# EAGLE schematic AK4493-v1.64_9 (EAGLE 9.6.2)
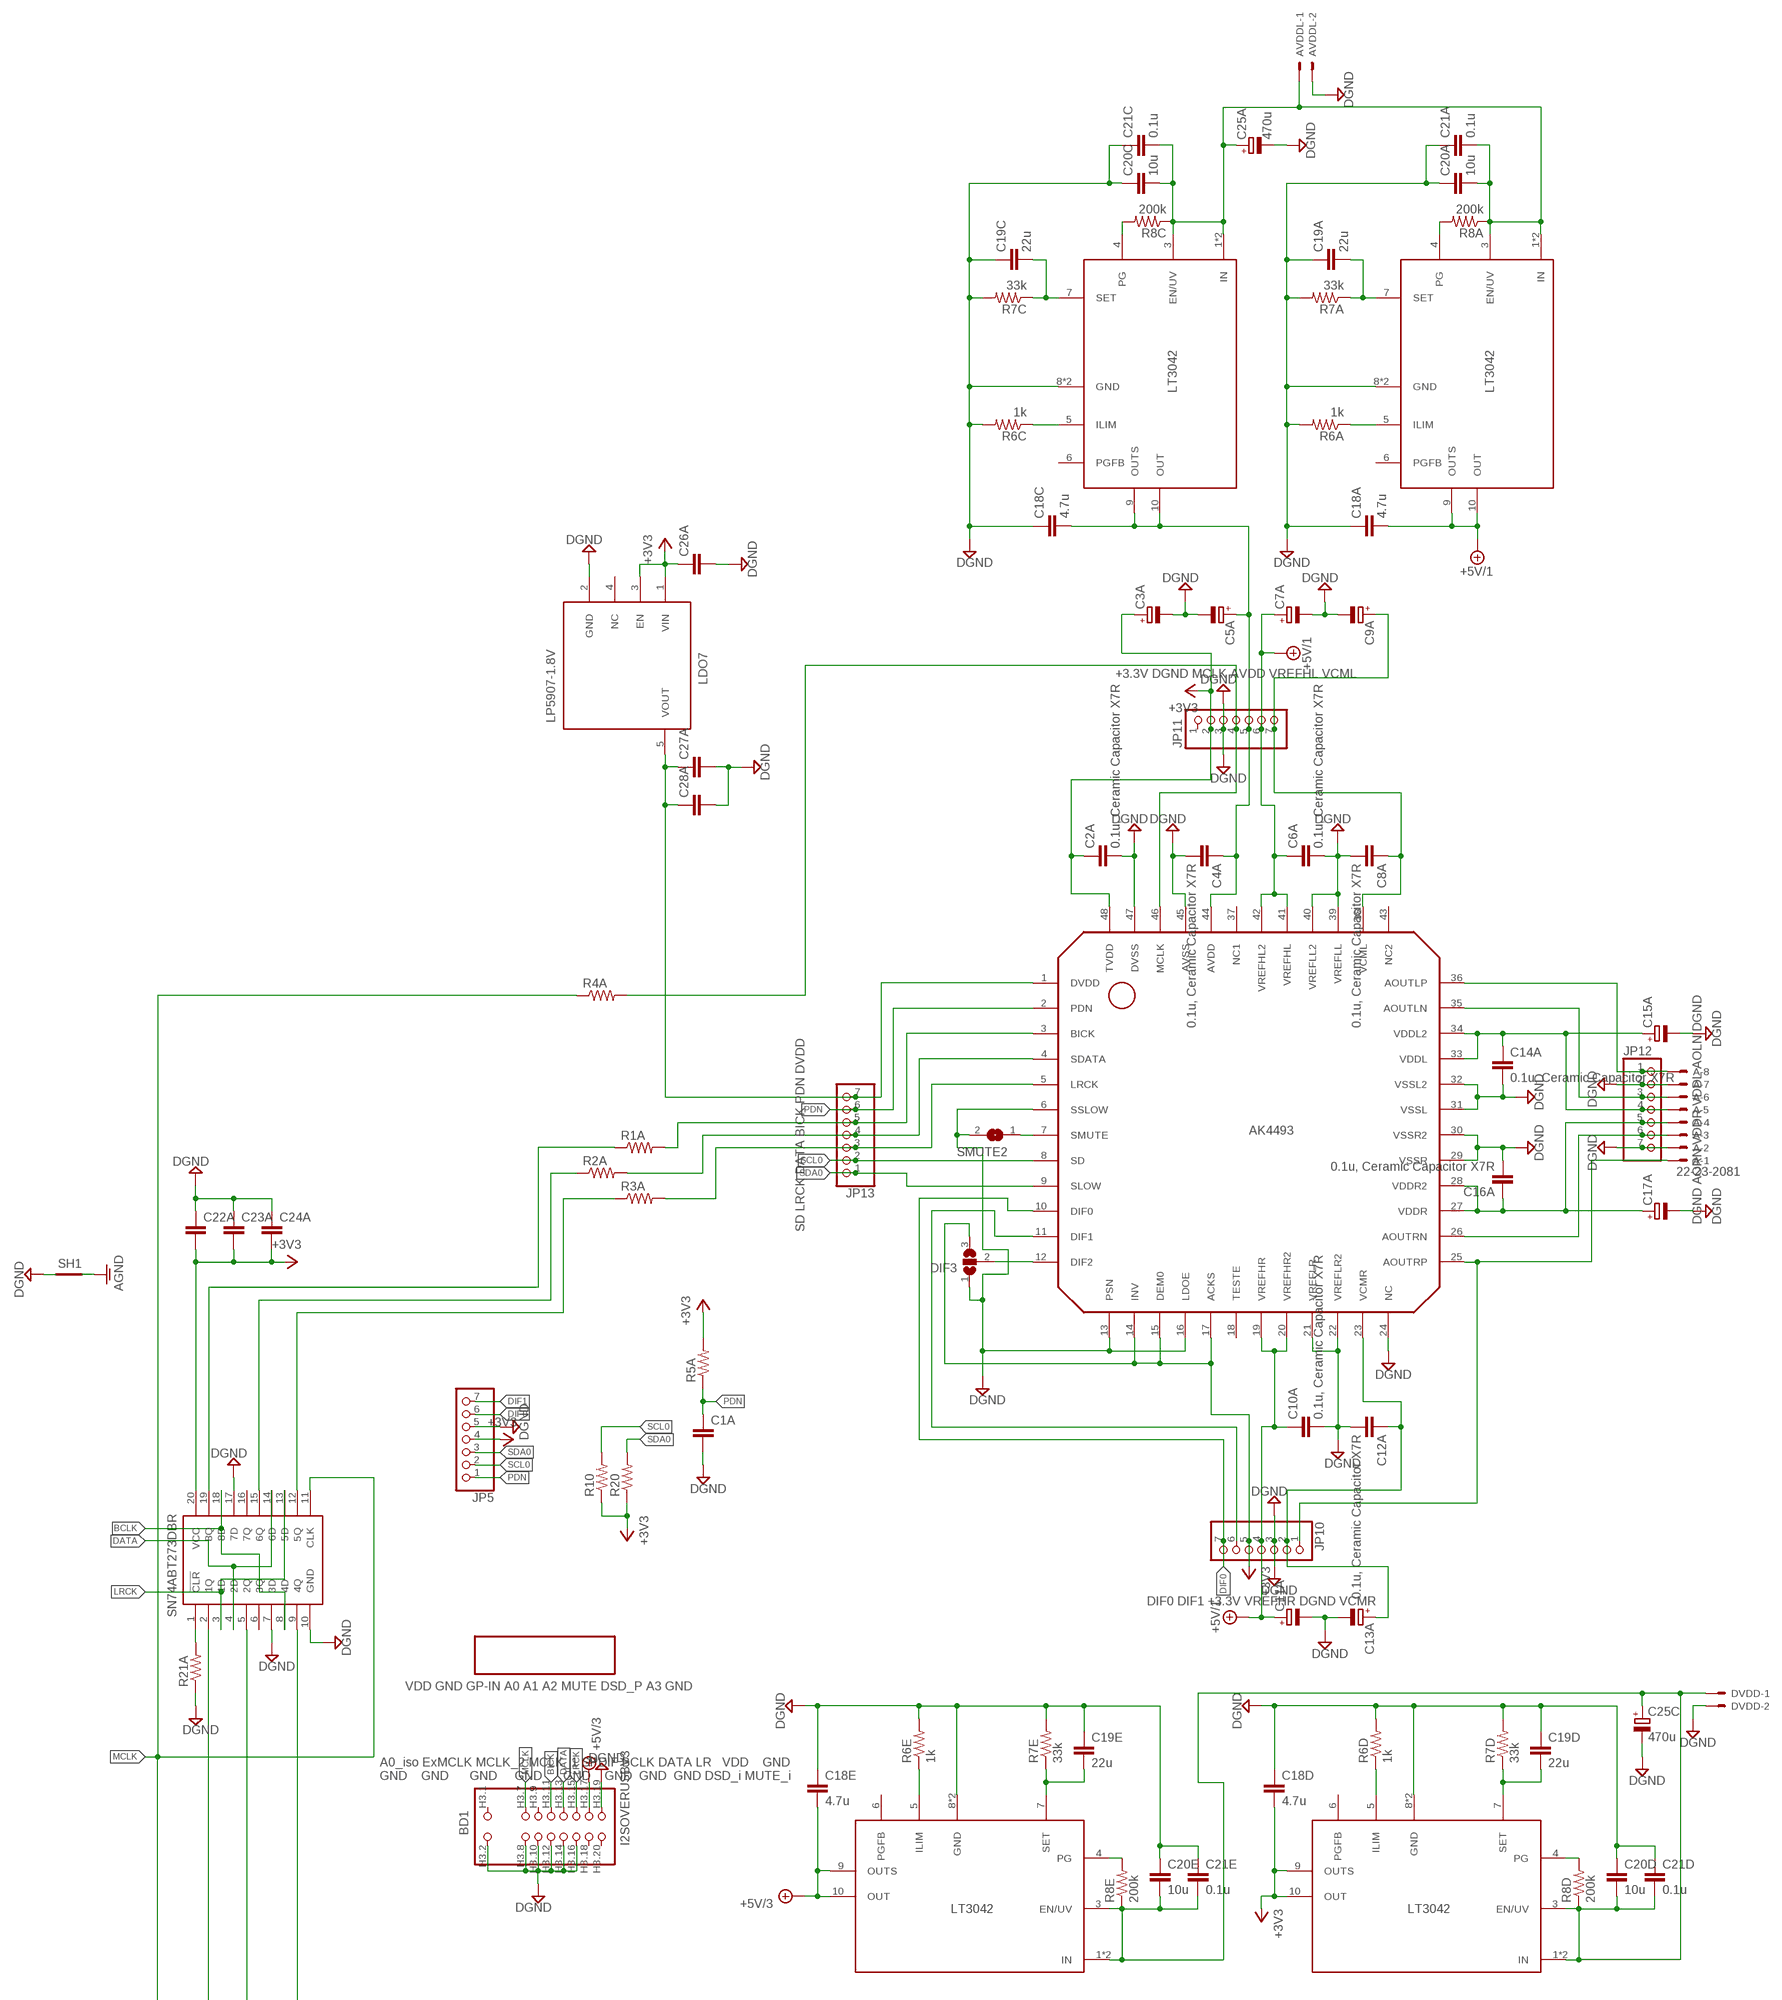
[diagram p0: schematic, sheet 1, part 1 of 2]
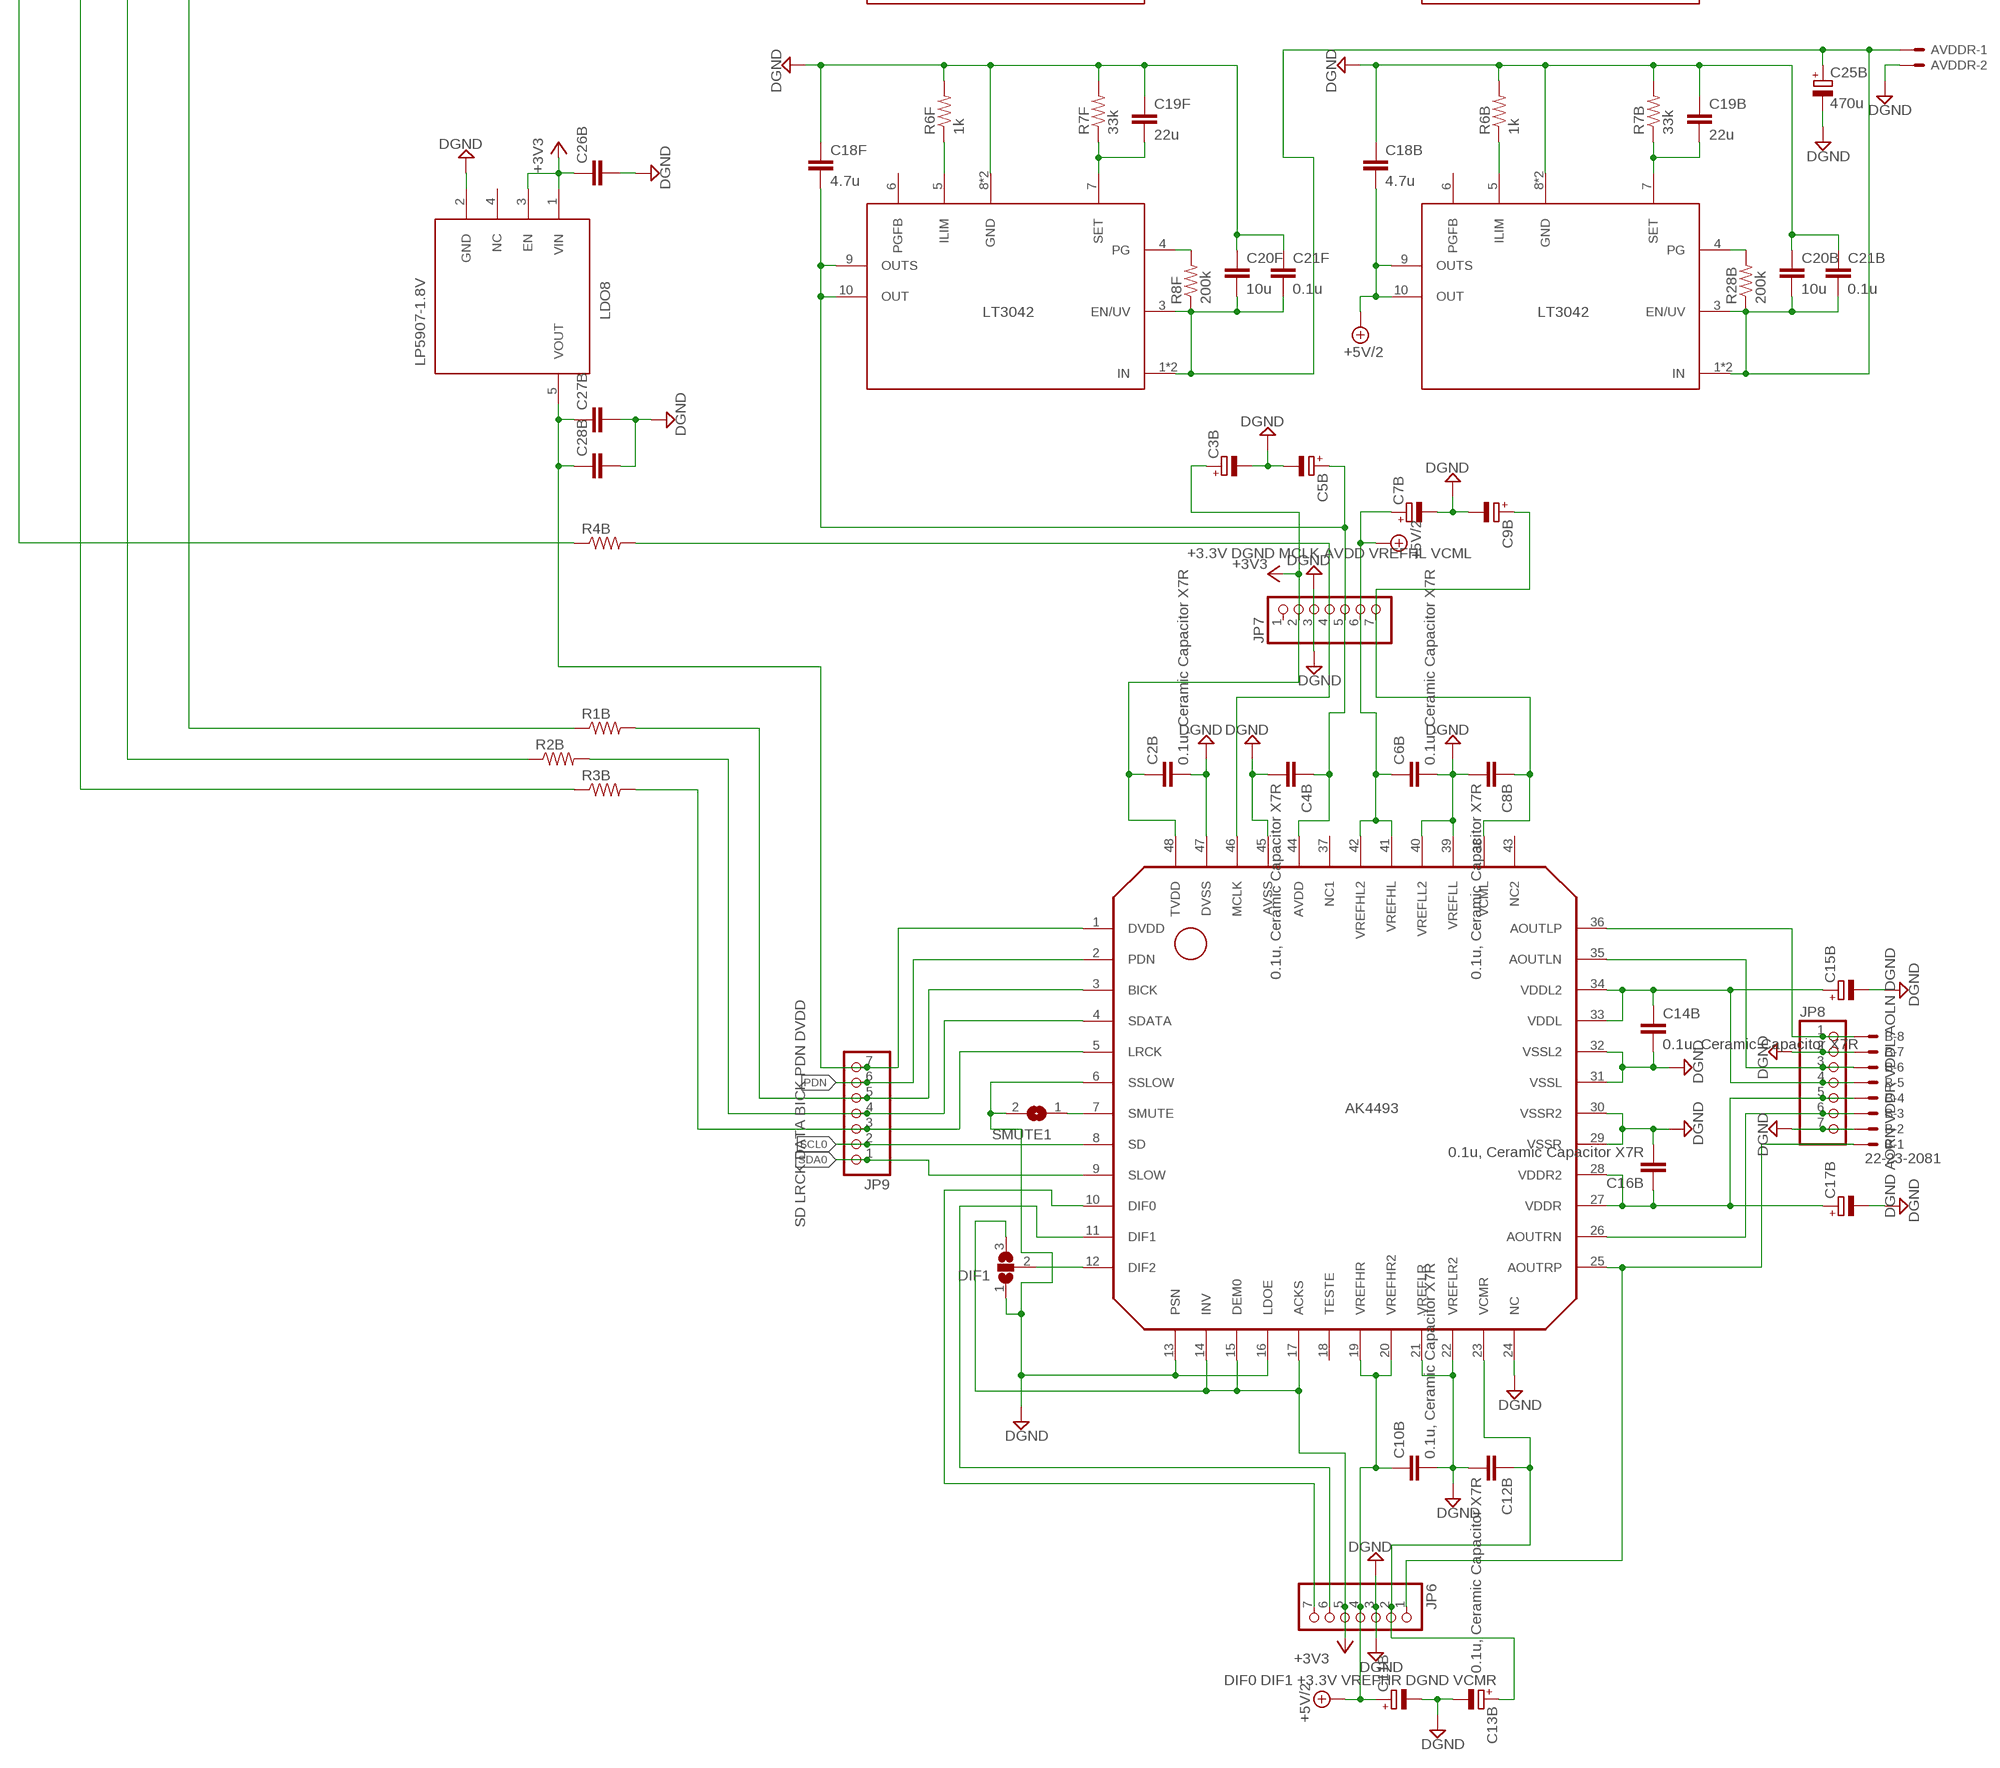
[diagram p1: schematic, sheet 1, part 2 of 2]

## Parts
A  22-23-2081  [22-23-2081]
AVDDL  22-23-2021  [22-23-2021]
AVDDR  22-23-2021  [22-23-2021]
B  22-23-2081  [22-23-2081]
BD1  I2SOVERUSBV3  [I2SOVERUSBV3]
C1A  C-EUC0805K  [C0805K]
C2A  0.1u, Ceramic Capacitor X7R  C-EUC0201  [C0201]
C2B  0.1u, Ceramic Capacitor X7R  C-EUC0201  [C0201]
C3A  CPOL-EUE2.5-5  [E2,5-5]
C3B  CPOL-EUE2.5-5  [E2,5-5]
C4A  0.1u, Ceramic Capacitor X7R  C-EUC0201  [C0201]
C4B  0.1u, Ceramic Capacitor X7R  C-EUC0201  [C0201]
C5A  CPOL-EUE2.5-5  [E2,5-5]
C5B  CPOL-EUE2.5-5  [E2,5-5]
C6A  0.1u, Ceramic Capacitor X7R  C-EUC0201  [C0201]
C6B  0.1u, Ceramic Capacitor X7R  C-EUC0201  [C0201]
C7A  CPOL-EUE5-8.5  [E5-8,5]
C7B  CPOL-EUE5-8.5  [E5-8,5]
C8A  0.1u, Ceramic Capacitor X7R  C-EUC0201  [C0201]
C8B  0.1u, Ceramic Capacitor X7R  C-EUC0201  [C0201]
C9A  CPOL-EUE2-4  [E2-4]
C9B  CPOL-EUE2-4  [E2-4]
C10A  0.1u, Ceramic Capacitor X7R  C-EUC0201  [C0201]
C10B  0.1u, Ceramic Capacitor X7R  C-EUC0201  [C0201]
C11A  CPOL-EUE5-8.5  [E5-8,5]
C11B  CPOL-EUE5-8.5  [E5-8,5]
C12A  0.1u, Ceramic Capacitor X7R  C-EUC0201  [C0201]
C12B  0.1u, Ceramic Capacitor X7R  C-EUC0201  [C0201]
C13A  CPOL-EUE2-4  [E2-4]
C13B  CPOL-EUE2-4  [E2-4]
C14A  0.1u, Ceramic Capacitor X7R  C-EUC0201  [C0201]
C14B  0.1u, Ceramic Capacitor X7R  C-EUC0201  [C0201]
C15A  CPOL-EUE2-4  [E2-4]
C15B  CPOL-EUE2-4  [E2-4]
C16A  0.1u, Ceramic Capacitor X7R  C-EUC0201  [C0201]
C16B  0.1u, Ceramic Capacitor X7R  C-EUC0201  [C0201]
C17A  CPOL-EUE2-4  [E2-4]
C17B  CPOL-EUE2-4  [E2-4]
C18A  4.7u  C-EUC0805K  [C0805K]
C18B  4.7u  C-EUC0805K  [C0805K]
C18C  4.7u  C-EUC0805K  [C0805K]
C18D  4.7u  C-EUC0805K  [C0805K]
C18E  4.7u  C-EUC0805K  [C0805K]
C18F  4.7u  C-EUC0805K  [C0805K]
C19A  22u  C-EUC1206K  [C1206K]
C19B  22u  C-EUC1206K  [C1206K]
C19C  22u  C-EUC1206K  [C1206K]
C19D  22u  C-EUC1206K  [C1206K]
C19E  22u  C-EUC1206K  [C1206K]
C19F  22u  C-EUC1206K  [C1206K]
C20A  10u  C-EUC0805K  [C0805K]
C20B  10u  C-EUC0805K  [C0805K]
C20C  10u  C-EUC0805K  [C0805K]
C20D  10u  C-EUC0805K  [C0805K]
C20E  10u  C-EUC0805K  [C0805K]
C20F  10u  C-EUC0805K  [C0805K]
C21A  0.1u  C-EUC0805K  [C0805K]
C21B  0.1u  C-EUC0805K  [C0805K]
C21C  0.1u  C-EUC0805K  [C0805K]
C21D  0.1u  C-EUC0805K  [C0805K]
C21E  0.1u  C-EUC0805K  [C0805K]
C21F  0.1u  C-EUC0805K  [C0805K]
C22A  C-EUC0603K  [C0603K]
C23A  C-EUC0603K  [C0603K]
C24A  C-EUC0603K  [C0603K]
C25A  470u  CPOL-EUE2.5-7  [E2,5-7]
C25B  470u  CPOL-EUE2.5-7  [E2,5-7]
C25C  470u  CPOL-EUE2.5-7  [E2,5-7]
C26A  C-EUC0805K  [C0805K]
C26B  C-EUC0805K  [C0805K]
C27A  C-EUC0805K  [C0805K]
C27B  C-EUC0805K  [C0805K]
C28A  C-EUC0603K  [C0603K]
C28B  C-EUC0603K  [C0603K]
DIF1  SJ2W  [SJ_2]
DIF3  SJ2W  [SJ_2]
DVDD  22-23-2021  [22-23-2021]
IC3  AK4493  [LQFP48]
IC4A  SN74ABT273DBR  [SOP65P780X200-20N]
IC9  AK4493  [LQFP48]
JP5  PINHD-1X7  [1X07]
JP6  PINHD-1X7  [1X07]
JP7  PINHD-1X7  [1X07]
JP8  PINHD-1X7  [1X07]
JP9  PINHD-1X7  [1X07]
JP10  PINHD-1X7  [1X07]
JP11  PINHD-1X7  [1X07]
JP12  PINHD-1X7  [1X07]
JP13  PINHD-1X7  [1X07]
LDO1  LT3042  [SOP50P490X110-11N]
LDO2  LT3042  [SOP50P490X110-11N]
LDO3  LT3042  [SOP50P490X110-11N]
LDO4  LT3042  [SOP50P490X110-11N]
LDO5  LT3042  [SOP50P490X110-11N]
LDO7  LP5907-1.8V  [SOT95P280X145-5N]
LDO8  LP5907-1.8V  [SOT95P280X145-5N]
LDO9  LT3042  [SOP50P490X110-11N]
R1A  R-US_R0603  [R0603]
R1B  R-US_R0603  [R0603]
R2A  R-US_R0603  [R0603]
R2B  R-US_R0603  [R0603]
R3A  R-US_R0603  [R0603]
R3B  R-US_R0603  [R0603]
R4A  R-US_R0603  [R0603]
R4B  R-US_R0603  [R0603]
R5A  R-US_R0805  [R0805]
R6A  1k  R-US_R0805  [R0805]
R6B  1k  R-US_R0805  [R0805]
R6C  1k  R-US_R0805  [R0805]
R6D  1k  R-US_R0805  [R0805]
R6E  1k  R-US_R0805  [R0805]
R6F  1k  R-US_R0805  [R0805]
R7A  33k  R-US_R0805  [R0805]
R7B  33k  R-US_R0805  [R0805]
R7C  33k  R-US_R0805  [R0805]
R7D  33k  R-US_R0805  [R0805]
R7E  33k  R-US_R0805  [R0805]
R7F  33k  R-US_R0805  [R0805]
R8A  200k  R-US_R0805  [R0805]
R8C  200k  R-US_R0805  [R0805]
R8D  200k  R-US_R0805  [R0805]
R8E  200k  R-US_R0805  [R0805]
R8F  200k  R-US_R0805  [R0805]
R10  R-US_R0805  [R0805]
R20  R-US_R0805  [R0805]
R21A  R-US_R0805  [R0805]
R28B  200k  R-US_R0805  [R0805]
SH1  SHORTA5  [SHORT_ALL-50]
SMUTE1  SJ  [SJ]
SMUTE2  SJ  [SJ]

## Nets
+3V3: C2A.1 C2B.1 C3A.+ C3B.+ C18D.2 C22A.2 C23A.2 C24A.2 C26A.1 C26B.1 DIF1.3 DIF3.3 IC3.14(INV) IC3.15(DEM0) IC3.17(ACKS) IC3.48(TVDD) IC4A.20(VCC) IC9.14(INV) IC9.15(DEM0) IC9.17(ACKS) IC9.48(TVDD) JP5.4 JP6.5 JP7.2 JP10.5 JP11.2 LDO1.9(OUTS) LDO1.10(OUT) LDO7.1(VIN) LDO7.3(EN) LDO8.1(VIN) LDO8.3(EN) R5A.2 R10.1 R20.1
+5V/1: C6A.1 C7A.+ C10A.1 C11A.+ C18A.2 IC9.19(VREFHR) IC9.20(VREFHR2) IC9.41(VREFHL) IC9.42(VREFHL2) JP10.4 JP11.6 LDO3.9(OUTS) LDO3.10(OUT)
+5V/2: C6B.1 C7B.+ C10B.1 C11B.+ C18B.2 IC3.19(VREFHR) IC3.20(VREFHR2) IC3.41(VREFHL) IC3.42(VREFHL2) JP6.4 JP7.6 LDO9.9(OUTS) LDO9.10(OUT)
+5V/3: BD1.H3.17 C18E.2 LDO2.9(OUTS) LDO2.10(OUT)
AGND: SH1.2
BCLK: IC4A.8(4D) IC4A.18(8D)
BICK: BD1.H3.11
DATA: BD1.H3.13 IC4A.4(2D) IC4A.14(6D)
DGND: A.2 A.7 AVDDL.2 AVDDR.2 B.2 B.7 BD1.H3.2 BD1.H3.8 BD1.H3.10 BD1.H3.12 BD1.H3.14 BD1.H3.16 BD1.H3.19 C1A.2 C2A.2 C2B.2 C3A.- C3B.- C4A.2 C4B.2 C5A.- C5B.- C6A.2 C6B.2 C7A.- C7B.- C8A.2 C8B.2 C9A.- C9B.- C10A.2 C10B.2 C11A.- C11B.- C12A.2 C12B.2 C13A.- C13B.- C14A.2 C14B.2 C15A.- C15B.- C16A.2 C16B.2 C17A.- C17B.- C18A.1 C18B.1 C18C.1 C18D.1 C18E.1 C18F.1 C19A.1 C19B.1 C19C.1 C19D.1 C19E.1 C19F.1 C20A.1 C20B.1 C20C.1 C20D.1 C20E.1 C20F.1 C21A.1 C21B.1 C21C.1 C21D.1 C21E.1 C21F.1 C22A.1 C23A.1 C24A.1 C25A.- C25B.- C25C.- C26A.2 C26B.2 C27A.2 C27B.2 C28A.2 C28B.2 DIF1.1 DIF3.1 DVDD.2 IC3.6(SSLOW) IC3.13(PSN) IC3.16(LDOE) IC3.21(VREFLR) IC3.22(VREFLR2) IC3.24(NC) IC3.29(VSSR) IC3.30(VSSR2) IC3.31(VSSL) IC3.32(VSSL2) IC3.39(VREFLL) IC3.40(VREFLL2) IC3.45(AVSS) IC3.47(DVSS) IC4A.7(3D) IC4A.10(GND) IC4A.17(7D) IC9.6(SSLOW) IC9.13(PSN) IC9.16(LDOE) IC9.21(VREFLR) IC9.22(VREFLR2) IC9.24(NC) IC9.29(VSSR) IC9.30(VSSR2) IC9.31(VSSL) IC9.32(VSSL2) IC9.39(VREFLL) IC9.40(VREFLL2) IC9.45(AVSS) IC9.47(DVSS) JP5.5 JP6.3 JP7.3 JP8.2 JP8.7 JP10.3 JP11.3 JP12.2 JP12.7 LDO1.8(GND) LDO1.11(GND) LDO2.8(GND) LDO2.11(GND) LDO3.8(GND) LDO3.11(GND) LDO4.8(GND) LDO4.11(GND) LDO5.8(GND) LDO5.11(GND) LDO7.2(GND) LDO8.2(GND) LDO9.8(GND) LDO9.11(GND) R6A.2 R6B.2 R6C.2 R6D.2 R6E.2 R6F.2 R7A.2 R7B.2 R7C.2 R7D.2 R7E.2 R7F.2 R21A.1 SH1.1 SMUTE1.2 SMUTE2.2
DIF0: IC9.10(DIF0) JP5.6 JP10.7
DIF1: JP5.7
LRCK: BD1.H3.15 IC4A.3(1D) IC4A.13(5D)
MCLK: BD1.H3.7 IC4A.11(CLK) R4A.1 R4B.1
N$1: IC4A.1(!CLR) R21A.2
N$2: IC3.10(DIF0) JP6.7
N$4: IC9.11(DIF1) JP10.6
N$5: LDO5.5(ILIM) R6C.1
N$6: LDO1.5(ILIM) R6D.1
N$7: C19D.2 LDO1.7(SET) R7D.1
N$8: LDO1.4(PG) R8D.2
N$9: LDO2.5(ILIM) R6E.1
N$10: C19E.2 LDO2.7(SET) R7E.1
N$11: IC3.46(MCLK) JP7.4 R4B.2
N$12: C12B.1 C13B.+ IC3.23(VCMR) JP6.2
N$13: LDO2.4(PG) R8E.2
N$14: C20D.2 C20E.2 C21D.2 C21E.2 C25C.+ DVDD.1 LDO1.1(IN) LDO1.2(IN) LDO1.3(EN/UV) LDO2.1(IN) LDO2.2(IN) LDO2.3(EN/UV) R8D.1 R8E.1
N$15: LDO3.5(ILIM) R6A.1
N$16: B.6 IC3.35(AOUTLN) JP8.3
N$17: B.5 C14B.1 C15B.+ IC3.33(VDDL) IC3.34(VDDL2) JP8.4
N$18: B.4 C16B.1 C17B.+ IC3.27(VDDR) IC3.28(VDDR2) JP8.5
N$19: IC9.5(LRCK) JP13.3 R3A.2
N$20: IC9.4(SDATA) JP13.4 R2A.2
N$21: IC9.3(BICK) JP13.5 R1A.2
N$22: C19A.2 LDO3.7(SET) R7A.1
N$23: IC4A.19(8Q) R1A.1
N$24: IC4A.15(6Q) R2A.1
N$25: IC4A.12(5Q) R3A.1
N$26: B.3 IC3.26(AOUTRN) JP8.6
N$27: IC3.3(BICK) JP9.5 R1B.2
N$28: IC3.4(SDATA) JP9.4 R2B.2
N$29: IC3.5(LRCK) JP9.3 R3B.2
N$30: IC4A.9(4Q) R1B.1
N$31: IC4A.5(2Q) R2B.1
N$32: IC4A.2(1Q) R3B.1
N$33: LDO3.4(PG) R8A.2
N$35: LDO4.5(ILIM) R6F.1
N$36: C19F.2 LDO4.7(SET) R7F.1
N$37: C27A.1 C28A.1 IC9.1(DVDD) JP13.7 LDO7.5(VOUT)
N$39: LDO4.4(PG) R8F.2
N$40: AVDDL.1 C20A.2 C20C.2 C21A.2 C21C.2 C25A.+ LDO3.1(IN) LDO3.2(IN) LDO3.3(EN/UV) LDO5.1(IN) LDO5.2(IN) LDO5.3(EN/UV) R8A.1 R8C.1
N$42: C4B.1 C5B.+ C18F.2 IC3.44(AVDD) JP7.5 LDO4.9(OUTS) LDO4.10(OUT)
N$43: C19C.2 LDO5.7(SET) R7C.1
N$44: LDO5.4(PG) R8C.2
N$46: C4A.1 C5A.+ C18C.2 IC9.44(AVDD) JP11.5 LDO5.9(OUTS) LDO5.10(OUT)
N$47: C8B.1 C9B.+ IC3.38(VCML) JP7.7
N$48: LDO9.5(ILIM) R6B.1
N$49: C19B.2 LDO9.7(SET) R7B.1
N$50: LDO9.4(PG) R28B.2
N$51: AVDDR.1 C20B.2 C20F.2 C21B.2 C21F.2 C25B.+ LDO4.1(IN) LDO4.2(IN) LDO4.3(EN/UV) LDO9.1(IN) LDO9.2(IN) LDO9.3(EN/UV) R8F.1 R28B.1
N$66: C27B.1 C28B.1 IC3.1(DVDD) JP9.7 LDO8.5(VOUT)
N$80: B.8 IC3.36(AOUTLP) JP8.1
N$81: A.8 IC9.36(AOUTLP) JP12.1
N$82: B.1 IC3.25(AOUTRP) JP6.1
N$83: A.6 IC9.35(AOUTLN) JP12.3
N$85: A.1 IC9.25(AOUTRP) JP10.1
N$86: A.3 IC9.26(AOUTRN) JP12.6
N$97: DIF1.2 IC3.12(DIF2)
N$98: IC3.7(SMUTE) SMUTE1.1
N$99: IC9.46(MCLK) JP11.4 R4A.2
N$100: IC3.11(DIF1) JP6.6
N$109: C8A.1 C9A.+ IC9.38(VCML) JP11.7
N$110: C12A.1 C13A.+ IC9.23(VCMR) JP10.2
N$112: DIF3.2 IC9.12(DIF2)
N$113: IC9.7(SMUTE) SMUTE2.1
N$117: A.5 C14A.1 C15A.+ IC9.33(VDDL) IC9.34(VDDL2) JP12.4
N$118: A.4 C16A.1 C17A.+ IC9.27(VDDR) IC9.28(VDDR2) JP12.5
PDN: C1A.1 IC3.2(PDN) IC9.2(PDN) JP5.1 JP9.6 JP13.6 R5A.1
SCL0: IC3.8(SD) IC9.8(SD) JP5.2 JP9.2 JP13.2 R10.2
SDA0: IC3.9(SLOW) IC9.9(SLOW) JP5.3 JP9.1 JP13.1 R20.2
Unconnected: BD1.H3.1 BD1.H3.9 BD1.H3.18 BD1.H3.20 IC3.18(TESTE) IC3.37(NC1) IC3.43(NC2) IC4A.6(3Q) IC4A.16(7Q) IC9.18(TESTE) IC9.37(NC1) IC9.43(NC2) JP7.1 JP11.1 LDO1.6(PGFB) LDO2.6(PGFB) LDO3.6(PGFB) LDO4.6(PGFB) LDO5.6(PGFB) LDO7.4(NC) LDO8.4(NC) LDO9.6(PGFB)

## Notes on the sheet
- +3.3V DGND MCLK AVDD VREFHL VCML
- DGND AORN VDDR VDDL AOLN DGND
- SD LRCK DATA BICK PDN DVDD
- DIF0 DIF1 +3.3V VREFHR DGND VCMR
- +3.3V DGND MCLK AVDD VREFHL VCML
- DGND AORN VDDR VDDL AOLN DGND
- SD LRCK DATA BICK PDN DVDD
- DIF0 DIF1 +3.3V VREFHR DGND VCMR

## Library data of the parts
A B = con-molex:22-23-2081: .100" (2.54mm) Center Header - 8 Pin; MF: MOLEX; MPN: 22-23-2081; OC_FARNELL: 1756826; OC_NEWARK: 01C7592
AVDDL AVDDR DVDD = con-molex:22-23-2021: .100" (2.54mm) Center Header - 2 Pin; MF: MOLEX; MPN: 22-23-2021; OC_FARNELL: 1462926; OC_NEWARK: 25C3832
BD1 = Hifi Nutube DAC (Next 6) 28:I2SOVERUSBV3: Asynchronous audio transfer at sampling rates up to 768 kHz and 32 bit; BOM: Yes; DESCRIPTION: Asynchronous audio transfer at sampling rates up to 768 kHz and 32 bit
C1A C2A C2B C4A C4B C6A C6B C8A C8B C10A C10B C12A C12B C14A C14B C16A C16B C18A C18B C18C C18D C18E C18F C19A C19B C19C C19D C19E C19F C20A C20B C20C C20D C20E C20F C21A C21B C21C C21D C21E C21F C22A C23A C24A C26A C26B C27A C27B C28A C28B = rcl:C-EU: CAPACITOR, European symbol; SPICEPREFIX: C
C3A C3B C5A C5B C7A C7B C9A C9B C11A C11B C13A C13B C15A C15B C17A C17B C25A C25B C25C = rcl:CPOL-EU: POLARIZED CAPACITOR, European symbol; SPICEPREFIX: C
DIF1 DIF3 = jumper:SJ2W: SMD solder JUMPER
IC3 IC9 = akm:AK4493: Quality Oriented 32-Bit 2ch DAC 32-Bit, 768 kHz with VELVET SOUND
IC4A = SN74ABT273DBR:SN74ABT273DBR: Octal Edge-Triggered D-Type Flip-Flops With Clear Source: Datasheet <http://www.ti.com/lit/gpn/sn74abt273>; DESCRIPTION: Octal Edge-Triggered D-Type Flip-Flops With Clear; HEIGHT: 2mm; MANUFACTURER_NAME: Texas Instruments; MANUFACTURER_PART_NUMBER: SN74ABT273DBR; MOUSER_PART_NUMBER: 595-SN74ABT273DBR; MOUSER_PRICE-STOCK: https://www.mouser.co.uk/ProductDetail/Texas-Instruments/SN74ABT273DBR?qs=X1HXWTtiZ0RWq%2Fv0JNOEpw%3D%3D
JP5-JP13 = pinhead:PINHD-1X7: PIN HEADER
LDO1-LDO5 LDO9 = LT3042EMSE#PBF:LT3042: LINEAR TECHNOLOGY - LT3042EMSE#PBF - LDO, ADJ, 0.2A, 0V-15V, MSOP-10 Source: Datasheet <http://www.linear.com/docs/46159>; DESCRIPTION: LINEAR TECHNOLOGY - LT3042EMSE#PBF - LDO, ADJ, 0.2A, 0V-15V, MSOP-10; HEIGHT: 1.1mm; MANUFACTURER_NAME: Linear Technology; MANUFACTURER_PART_NUMBER: LT3042EMSE#PBF; MOUSER_PART_NUMBER: 584-LT3042EMSE#PBF; MOUSER_PRICE-STOCK: https://www.mouser.co.uk/ProductDetail/Analog-Devices-Linear-Technology/LT3042EMSEPBF?qs=oahfZPh6IAJ3XP16d20ITw%3D%3D
LDO7 LDO8 = LP5907-1.8V:LP5907-1.8V: 250-mA ultra-low-noise low-IQ low-dropout (LDO) linear regulator Source: Datasheet <http://www.ti.com/lit/gpn/lp5907>; ARROW_PART_NUMBER: LP5907MFX-1.8/NOPB; ARROW_PRICE-STOCK: https://www.arrow.com/en/products/lp5907mfx-1.8nopb/texas-instruments?region=nac; DESCRIPTION: 250-mA ultra-low-noise low-IQ low-dropout (LDO) linear regulator; HEIGHT: 1.45mm; MANUFACTURER_NAME: Texas Instruments; MANUFACTURER_PART_NUMBER: LP5907MFX-1.8/NOPB; MOUSER_PART_NUMBER: 595-LP5907MFX-1.8NPB; MOUSER_PRICE-STOCK: https://www.mouser.co.uk/ProductDetail/Texas-Instruments/LP5907MFX-1.8-NOPB?qs=biyDIajrTn5jh5ArkSZeqw%3D%3D
R1A R1B R2A R2B R3A R3B R4A R4B R5A R6A R6B R6C R6D R6E R6F R7A R7B R7C R7D R7E R7F R8A R8C R8D R8E R8F R10 R20 R21A R28B = rcl:R-US_: RESISTOR, American symbol; SPICEPREFIX: R
SH1 = Hifi Nutube DAC (Next 6) 28:SHORT: Short between two nets; BOM: No; DESCRIPTION: Short between two nets
SMUTE1 SMUTE2 = jumper:SJ: SMD solder JUMPER

## Net classes
3 Power: width 1.27 mm, drill 1.27 mm, clearance 0.254 mm